# EAGLE design mega-breakout-v1 (EAGLE 7.1.0)
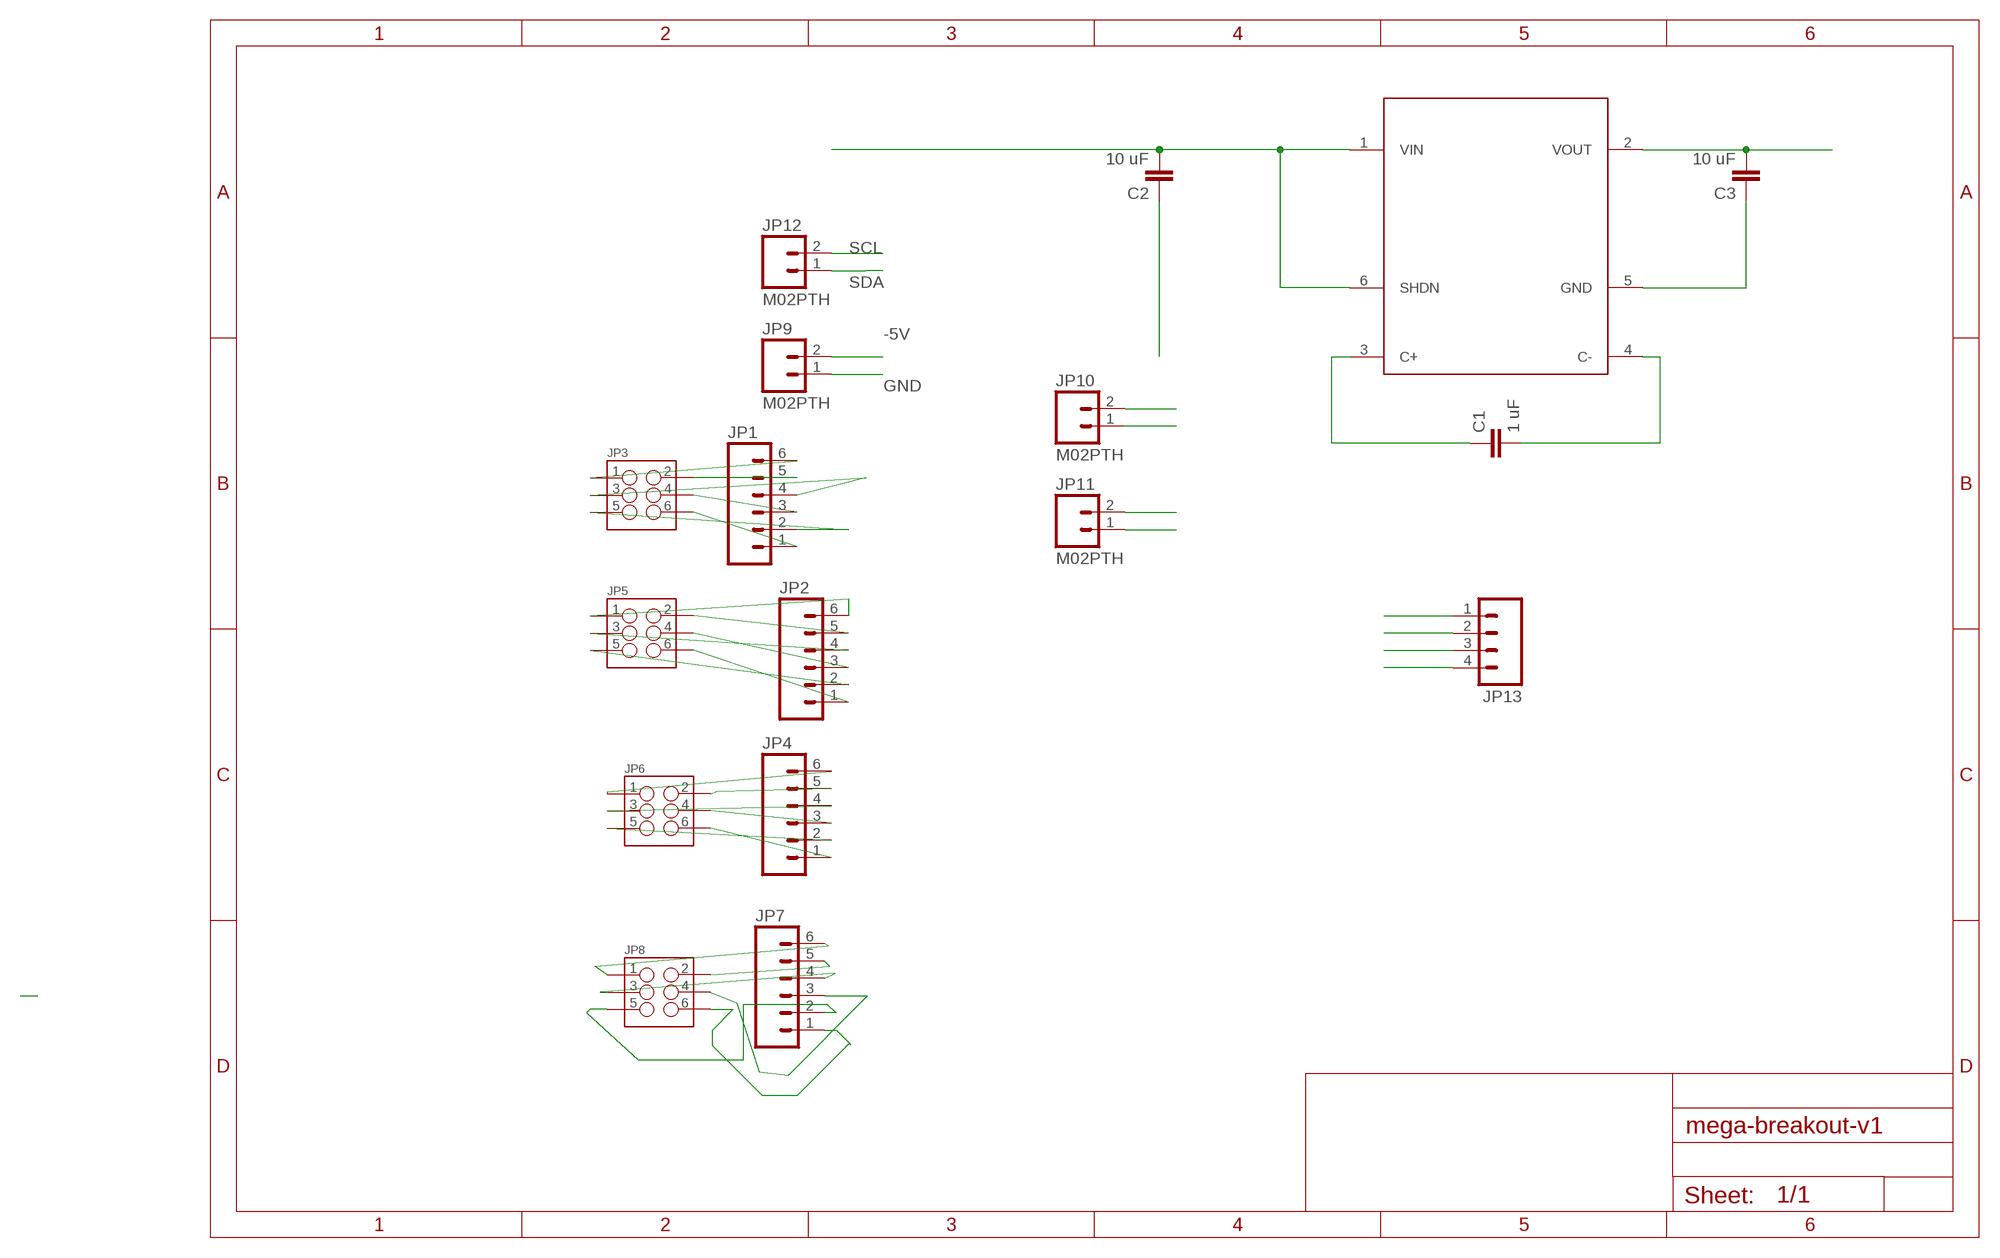
[diagram p0: schematic, sheet 1]

## Parts
C1  1 uF  CAP0805  [0805]
C2  10 uF  CAP0805  [0805]
C3  10 uF  CAP0805  [0805]
JP1  M06NO_SILK  [1X06_NO_SILK]
JP2  M06NO_SILK  [1X06_NO_SILK]
JP3  M03X22X3_SILK_SM  [2X3]
JP4  M06NO_SILK  [1X06_NO_SILK]
JP5  M03X22X3_SILK_SM  [2X3]
JP6  M03X22X3_SILK_SM  [2X3]
JP7  M06NO_SILK  [1X06_NO_SILK]
JP8  M03X22X3_SILK_SM  [2X3]
JP9  M02PTH  [1X02]
JP10  M02PTH  [1X02]
JP11  M02PTH  [1X02]
JP12  M02PTH  [1X02]
JP13  M04PTH  [1X04]
U1  LTC1983  [SSOT23-6]

## Nets
-5V: C3.2 JP9.2 U1.2(VOUT)
A1: JP7.6 JP8.1
A2: JP7.5 JP8.2
A3: JP7.4 JP8.3
A4: JP7.3 JP8.4
A5: JP7.2 JP8.5
A6: JP7.1 JP8.6
B1: JP4.6 JP6.1
B2: JP4.5 JP6.2
B3: JP4.4 JP6.3
B4: JP4.3 JP6.4
B5: JP4.2 JP6.5
B6: JP4.1 JP6.6
C1: JP2.6 JP5.1
C2: JP2.5 JP5.2
C3: JP2.4 JP5.3
C4: JP2.3 JP5.4
C5: JP2.2 JP5.5
C6: JP2.1 JP5.6
D1: JP1.6 JP3.1
D2: JP1.5 JP3.2
D3: JP1.4 JP3.3
D4: JP1.3 JP3.4
D5: JP1.2 JP3.5
D6: JP1.1 JP3.6
GND: JP9.1 JP13.3
N$10: JP10.2
N$11: JP10.1
N$33: C1.2 U1.4(C-)
N$34: C1.1 U1.3(C+)
SCL: JP12.2 JP13.2
SDA: JP12.1 JP13.1
VCC: C2.2 JP11.1 JP11.2 JP13.4 U1.1(VIN) U1.6(SHDN)
VCC1: C2.1 C3.1 U1.5(GND)

## Library data of the parts
C1-C3 = SparkFun-Capacitors:CAP: Capacitor Standard 0603 ceramic capacitor, and 0.1" leaded capacitor.
JP1 JP2 JP4 JP7 = SparkFun-Connectors:M06: Header 6 Standard 6-pin 0.1" header. Use with straight break away headers (SKU : PRT-00116), right angle break away headers (PRT-00553), swiss pins (PRT-00743), machine pins (PRT-00117), and female headers (PRT-00115). Molex polarized connector foot print use with SKU : PRT-08094 with associated crimp pins and housings. NOTES ON THE VARIANTS LOCK and LOCK_LONGPADS... This footprint was designed to help hold the alignment of a through-hole component (i.e. 6-pin header) while soldering it into place. You may notice that each hole has been shifted either up or down by 0.005 of an inch from it's more standard position (which is a perfectly straight line). This slight alteration caused the pins (the squares in the middle) to touch the edges of the holes. Because they are alternating, it causes a "brace" to hold the component in place. 0.005 has proven to be the perfect amount of "off-center" position when using our standard breakaway headers. Although looks a little odd when you look at the bare footprint, once you have a header in there, the alteration is very hard to notice. Also,if you push a header all the way into place, it is covered up entirely on the bottom side. This idea of altering the position of holes to aid alignment will be further integrated into the Sparkfun Library for other footprints. It can help hold any component with 3 or more connection pins.
JP3 JP5 JP6 JP8 = SparkFun-Connectors:M03X2: 2x3 .1" header. Shrouded, with keying- CONN-10681 SMT- CONN-11415 Pogo pins- HW-11044
JP9-JP12 = SparkFun-Connectors:M02: Standard 2-pin 0.1" header. Use with - straight break away headers ( PRT-00116) - right angle break away headers (PRT-00553) - swiss pins (PRT-00743) - machine pins (PRT-00117) - female headers (PRT-00115) Molex polarized connector foot print use with: PRT-08233 with associated crimp pins and housings. 2.54_SCREWTERM for use with PRT-10571. 3.5mm Screw Terminal footprints for PRT-08084 5mm Screw Terminal footprints for use with PRT-08432
JP13 = SparkFun-Connectors:M04: Header 4 Standard 4-pin 0.1" header. Use with straight break away headers (SKU : PRT-00116), right angle break away headers (PRT-00553), swiss pins (PRT-00743), machine pins (PRT-00117), and female headers (PRT-00115). Molex polarized connector foot print use with SKU : PRT-08231 with associated crimp pins and housings. 1MM SMD Version SKU: PRT-10208
U1 = spietz-library:LTC1983

## Net classes
1 vcc: width 0.254 mm

## Board
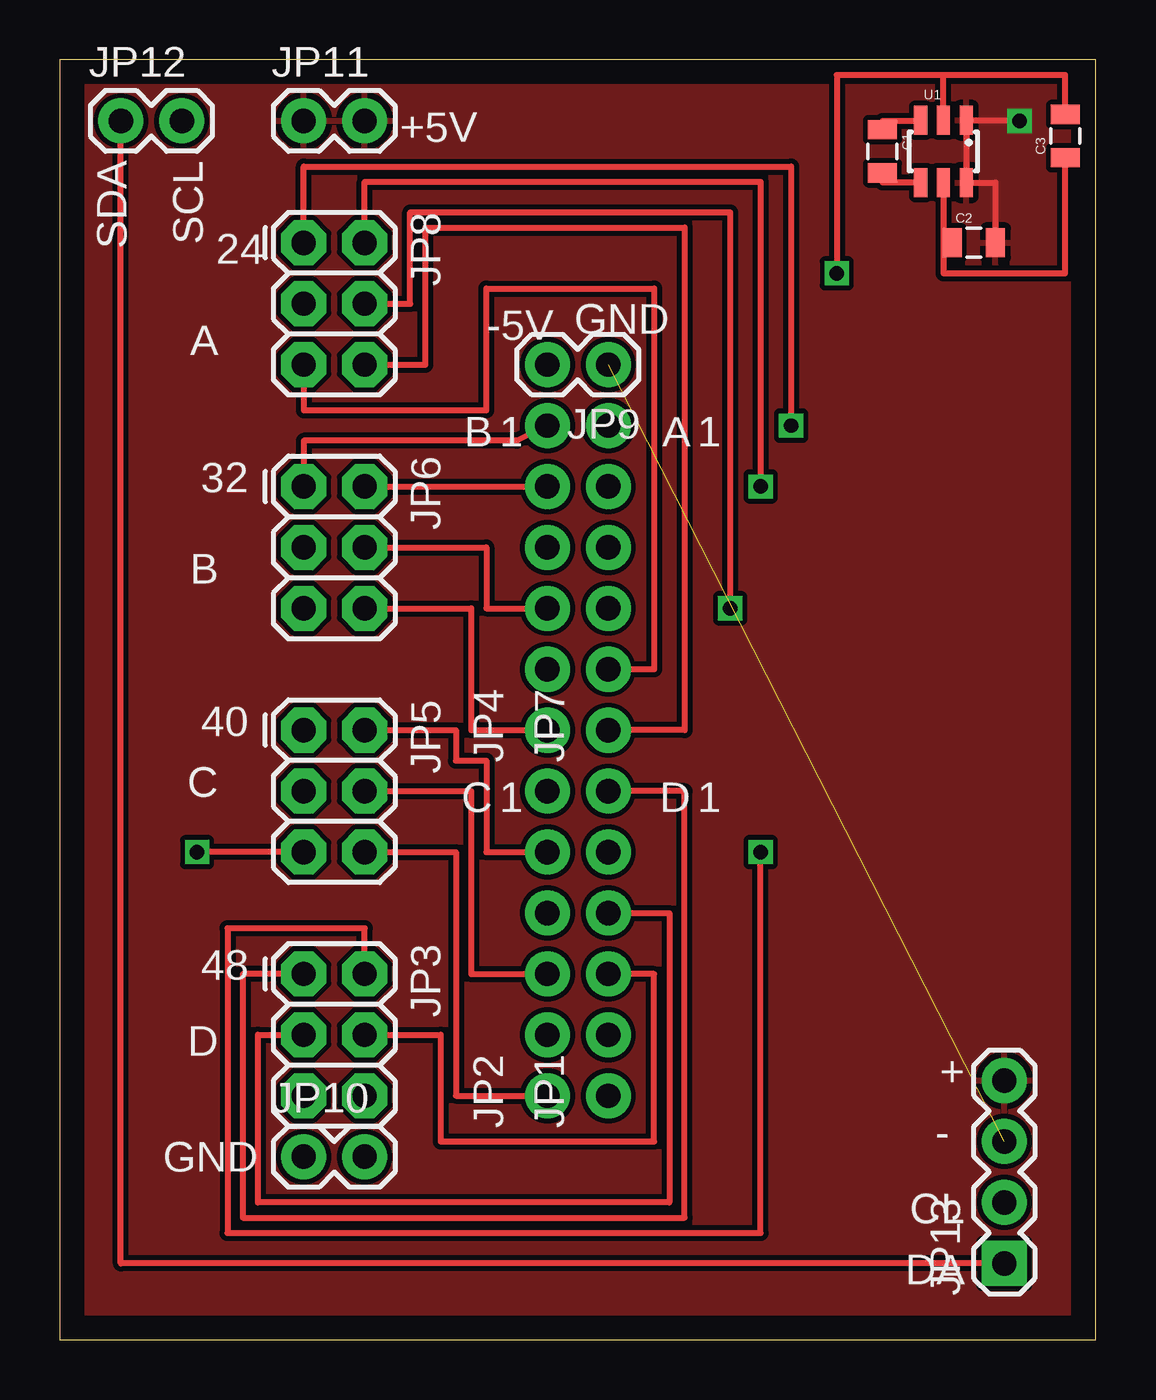
[diagram p1: board, top side]
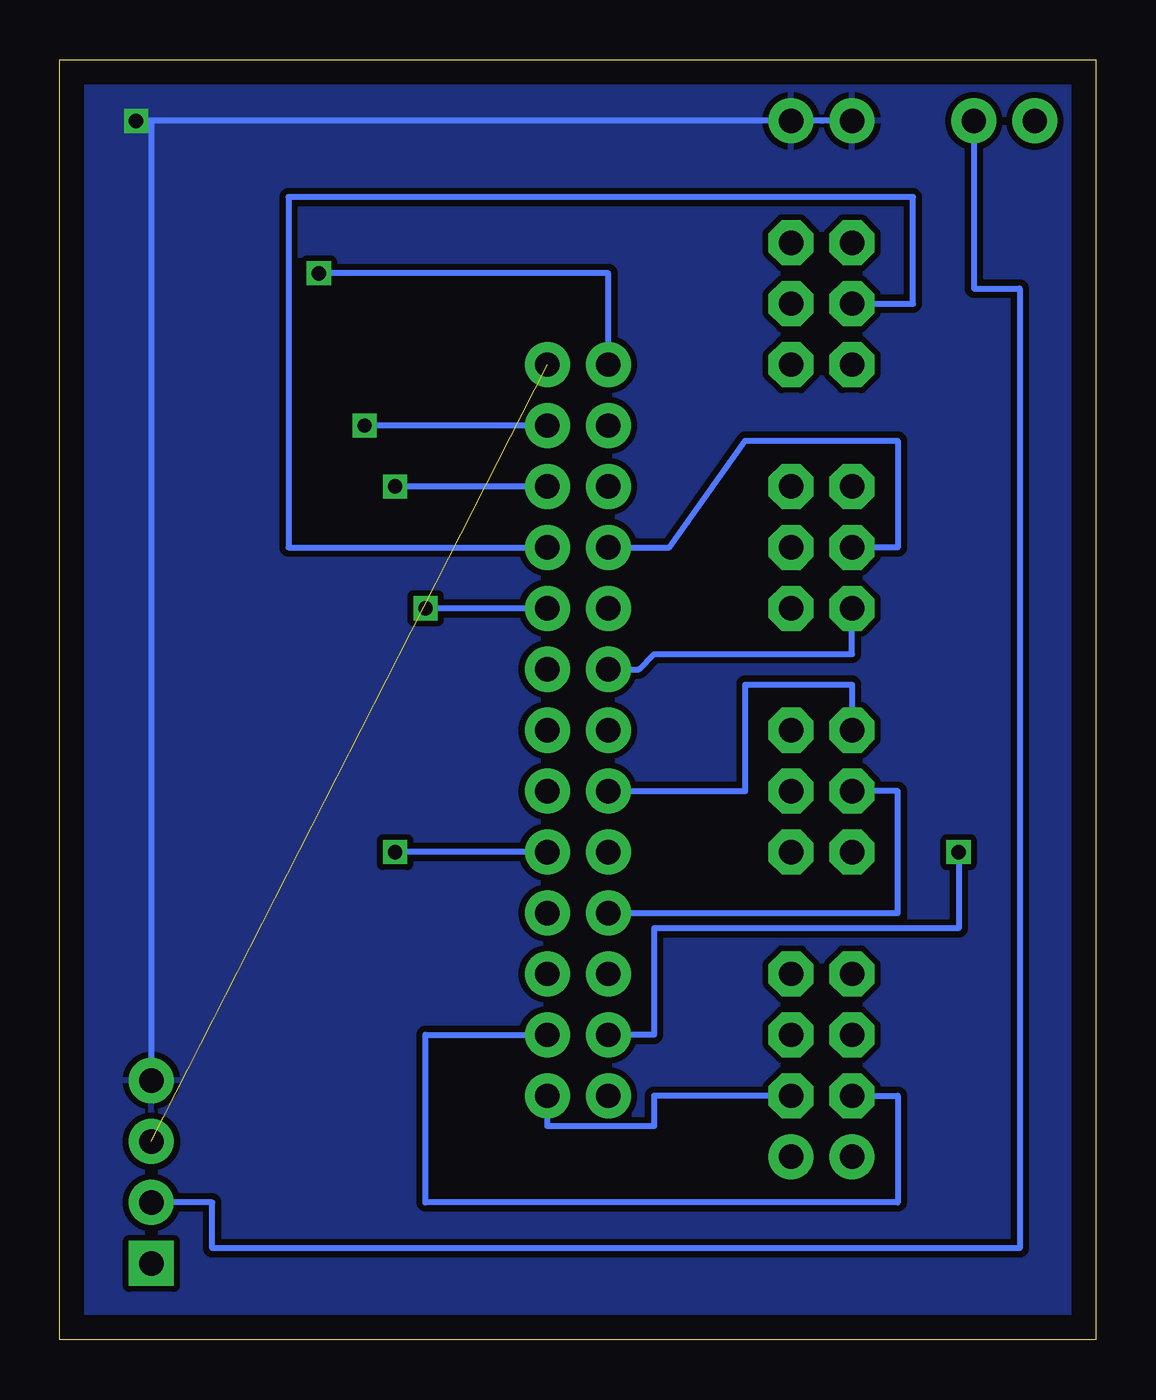
[diagram p2: board, bottom side, seen from below]

Size 43.18 x 53.34 mm. Coordinates in mm from the lower left corner, seen from the top.
Outline: 0,0 43.18,0 43.18,53.34 0,53.34 0,0
Copper layers (1*16): Top 0.035mm / dielectric 1.5mm / Bottom 0.035mm
Design rules "default": minimum track width 10mil, minimum drill 24mil, track to track 8mil, track to pad 8mil, pad to pad 8mil, via to via 8mil, smd to smd 8mil, copper to edge 40mil, drill to drill 8mil, minimum pad ring 10mil, minimum via ring 8mil, stop-mask expansion 4mil, vias tented up to drill 0mil, thermal gap 10mil

### Footprints (pad centres in the part's own frame; a part is rotated, then mirrored left to right if it is on the bottom)
0805 = smd 0.8 x 1.2: 1 -0.9,0; 2 0.9,0
1X06_NO_SILK = drill 1.016 pad 1.88: 1 0,0; 2 2.54,0; 3 5.08,0; 4 7.62,0; 5 10.16,0; 6 12.7,0
2X3 = drill 1.016 pad 1.88 octagon: 1 0,0; 2 0,2.54; 3 2.54,0; 4 2.54,2.54; 5 5.08,0; 6 5.08,2.54
1X02 = drill 1.016 pad 1.88: 1 0,0; 2 2.54,0
1X04 = drill 1.016 pad 1.88 square: 1 0,0 | drill 1.016 pad 1.88: 2 2.54,0; 3 5.08,0; 4 7.62,0
SSOT23-6 = smd 0.55 x 1.2: 1 0.95,1.3; 2 0,1.3; 3 -0.95,1.3; 4 -0.95,-1.3; 5 0,-1.3; 6 0.95,-1.3

### Placement (x,y rotation side)
C1  34.29,49.53 270 top
C2  38.1,45.72 0 top
C3  41.91,50.16 90 top
JP1  22.86,10.16 90 top
JP2  20.32,10.16 90 top
JP3  10.16,15.24 270 top
JP4  20.32,25.4 90 top
JP5  10.16,25.4 270 top
JP6  10.16,35.56 270 top
JP7  22.86,25.4 90 top
JP8  10.16,45.72 270 top
JP9  22.86,40.64 180 top
JP10  10.16,7.62 0 top
JP11  10.16,50.8 0 top
JP12  2.54,50.8 0 top
JP13  39.37,3.17 90 top
U1  36.83,49.53 0 top

### Tracks (layer width: path | path; a pad name or v marks a point on that pad's centre or on a via)
-5V  (via drill 0.6)
  Top 0.254: C3.2 41.91,52.7 36.83,52.7 | U1.2 36.83,52.7 | 36.83,52.7 32.38,52.7 v32.38,44.45
  Bottom 0.254: JP9.2 20.32,44.45 v32.38,44.45
A1  (via drill 0.6)
  Top 0.254: JP8.1 10.16,48.9 30.48,48.9 v30.48,38.1
  Bottom 0.254: JP7.6 v30.48,38.1
A2  (via drill 0.6)
  Top 0.254: JP8.2 12.7,48.26 29.21,48.26 v29.21,35.56
  Bottom 0.254: JP7.5 v29.21,35.56
A3
  Bottom 0.254: JP8.3 7.62,43.18 7.62,47.62 33.66,47.62 33.66,33.02 JP7.4
A4  (via drill 0.6)
  Top 0.254: JP8.4 14.61,43.18 14.61,46.99 27.94,46.99 v27.94,30.48
  Bottom 0.254: JP7.3 v27.94,30.48
A5
  Top 0.254: JP8.5 10.16,38.73 17.78,38.73 17.78,43.81 24.77,43.81 24.77,27.94 JP7.2
A6
  Top 0.254: JP8.6 15.24,40.64 15.24,46.35 26.04,46.35 26.04,25.4 JP7.1
B1
  Top 0.254: JP4.6 19.05,37.47 10.16,37.47 JP6.1
B2
  Top 0.254: JP6.2 JP4.5
B3
  Bottom 0.254: JP4.4 17.78,33.02 14.61,37.47 8.26,37.47 8.26,33.02 JP6.3
B4
  Top 0.254: JP6.4 17.78,33.02 17.78,30.48 JP4.3
B5
  Bottom 0.254: JP4.2 19.05,27.94 18.41,28.57 10.16,28.57 JP6.5
B6
  Top 0.254: JP6.6 17.14,30.48 17.14,25.4 JP4.1
C1
  Bottom 0.254: JP2.6 14.61,22.86 14.61,27.3 10.16,27.3 JP5.1
C2
  Top 0.254: JP5.2 16.51,25.4 16.51,24.13 17.78,24.13 17.78,20.32 JP2.5
C3
  Bottom 0.254: JP2.4 8.26,17.78 8.26,22.86 JP5.3
C4
  Top 0.254: JP5.4 17.14,22.86 17.14,15.24 JP2.3
C5  (via drill 0.6)
  Top 0.254: JP5.5 v5.71,20.32
  Bottom 0.254: v5.71,20.32 5.71,17.14 18.41,17.14 18.41,12.7 JP2.2
C6
  Top 0.254: JP5.6 16.51,20.32 16.51,10.16 JP2.1
D1
  Top 0.254: JP3.1 7.62,15.24 7.62,5.08 26.04,5.08 26.04,22.86 JP1.6
D2  (via drill 0.6)
  Top 0.254: JP3.2 12.7,17.14 6.99,17.14 6.99,4.45 29.21,4.45 v29.21,20.32
  Bottom 0.254: JP1.5 v29.21,20.32
D3
  Top 0.254: JP1.4 25.4,17.78 25.4,5.71 8.26,5.71 8.26,12.7 JP3.3
D4
  Top 0.254: JP3.4 15.88,12.7 15.88,8.26 24.77,8.26 24.77,15.24 JP1.3
D5
  Bottom 0.254: JP1.2 27.94,12.7 27.94,5.71 8.26,5.71 8.26,10.16 JP3.5
D6
  Bottom 0.254: JP3.6 18.41,10.16 18.41,8.89 22.86,8.89 JP1.1
GND  (1 unrouted)
N$33
  Top 0.254: U1.4 34.29,48.23 C1.2
N$34
  Top 0.254: C1.1 34.29,50.8 35.88,50.8 U1.3
SCL
  Bottom 0.254: JP12.2 5.08,43.81 3.17,43.81 3.17,3.81 36.83,3.81 36.83,5.71 JP13.2
SDA
  Top 0.254: JP13.1 2.54,3.17 JP12.1
VCC  (via drill 0.6)
  Top 0.254: C2.2 39,48.23 U1.6 U1.1 40.01,50.83 v40.01,50.8
  Bottom 0.254: v40.01,50.8 JP11.2 JP11.1 39.37,50.8 JP13.4
  pour Top (isolate 0.152): -8.89,59.18 -7.37,-10.92 55.63,-10.67 58.17,61.21
  pour Bottom (isolate 0.254): -7.62,57.28 -7.37,-5.08 54.1,-7.87 54.86,57.78
VCC1
  Top 0.254: U1.5 36.83,45.72 | C2.1 36.83,45.72 | 36.83,45.72 36.83,44.45 41.91,44.45 C3.1

### Text on the board
tPlace: +5V | SDA | SCL | 24 | -5V | GND | A | B | 1 | A | 1 | 32 | B | 40 | C | C | 1 | D | 1 | 48 | D | + | - | GND | CL | DA